# Altium schematic sheet A7_FUNCTION2 - Ⅱ.SchDoc
size A3
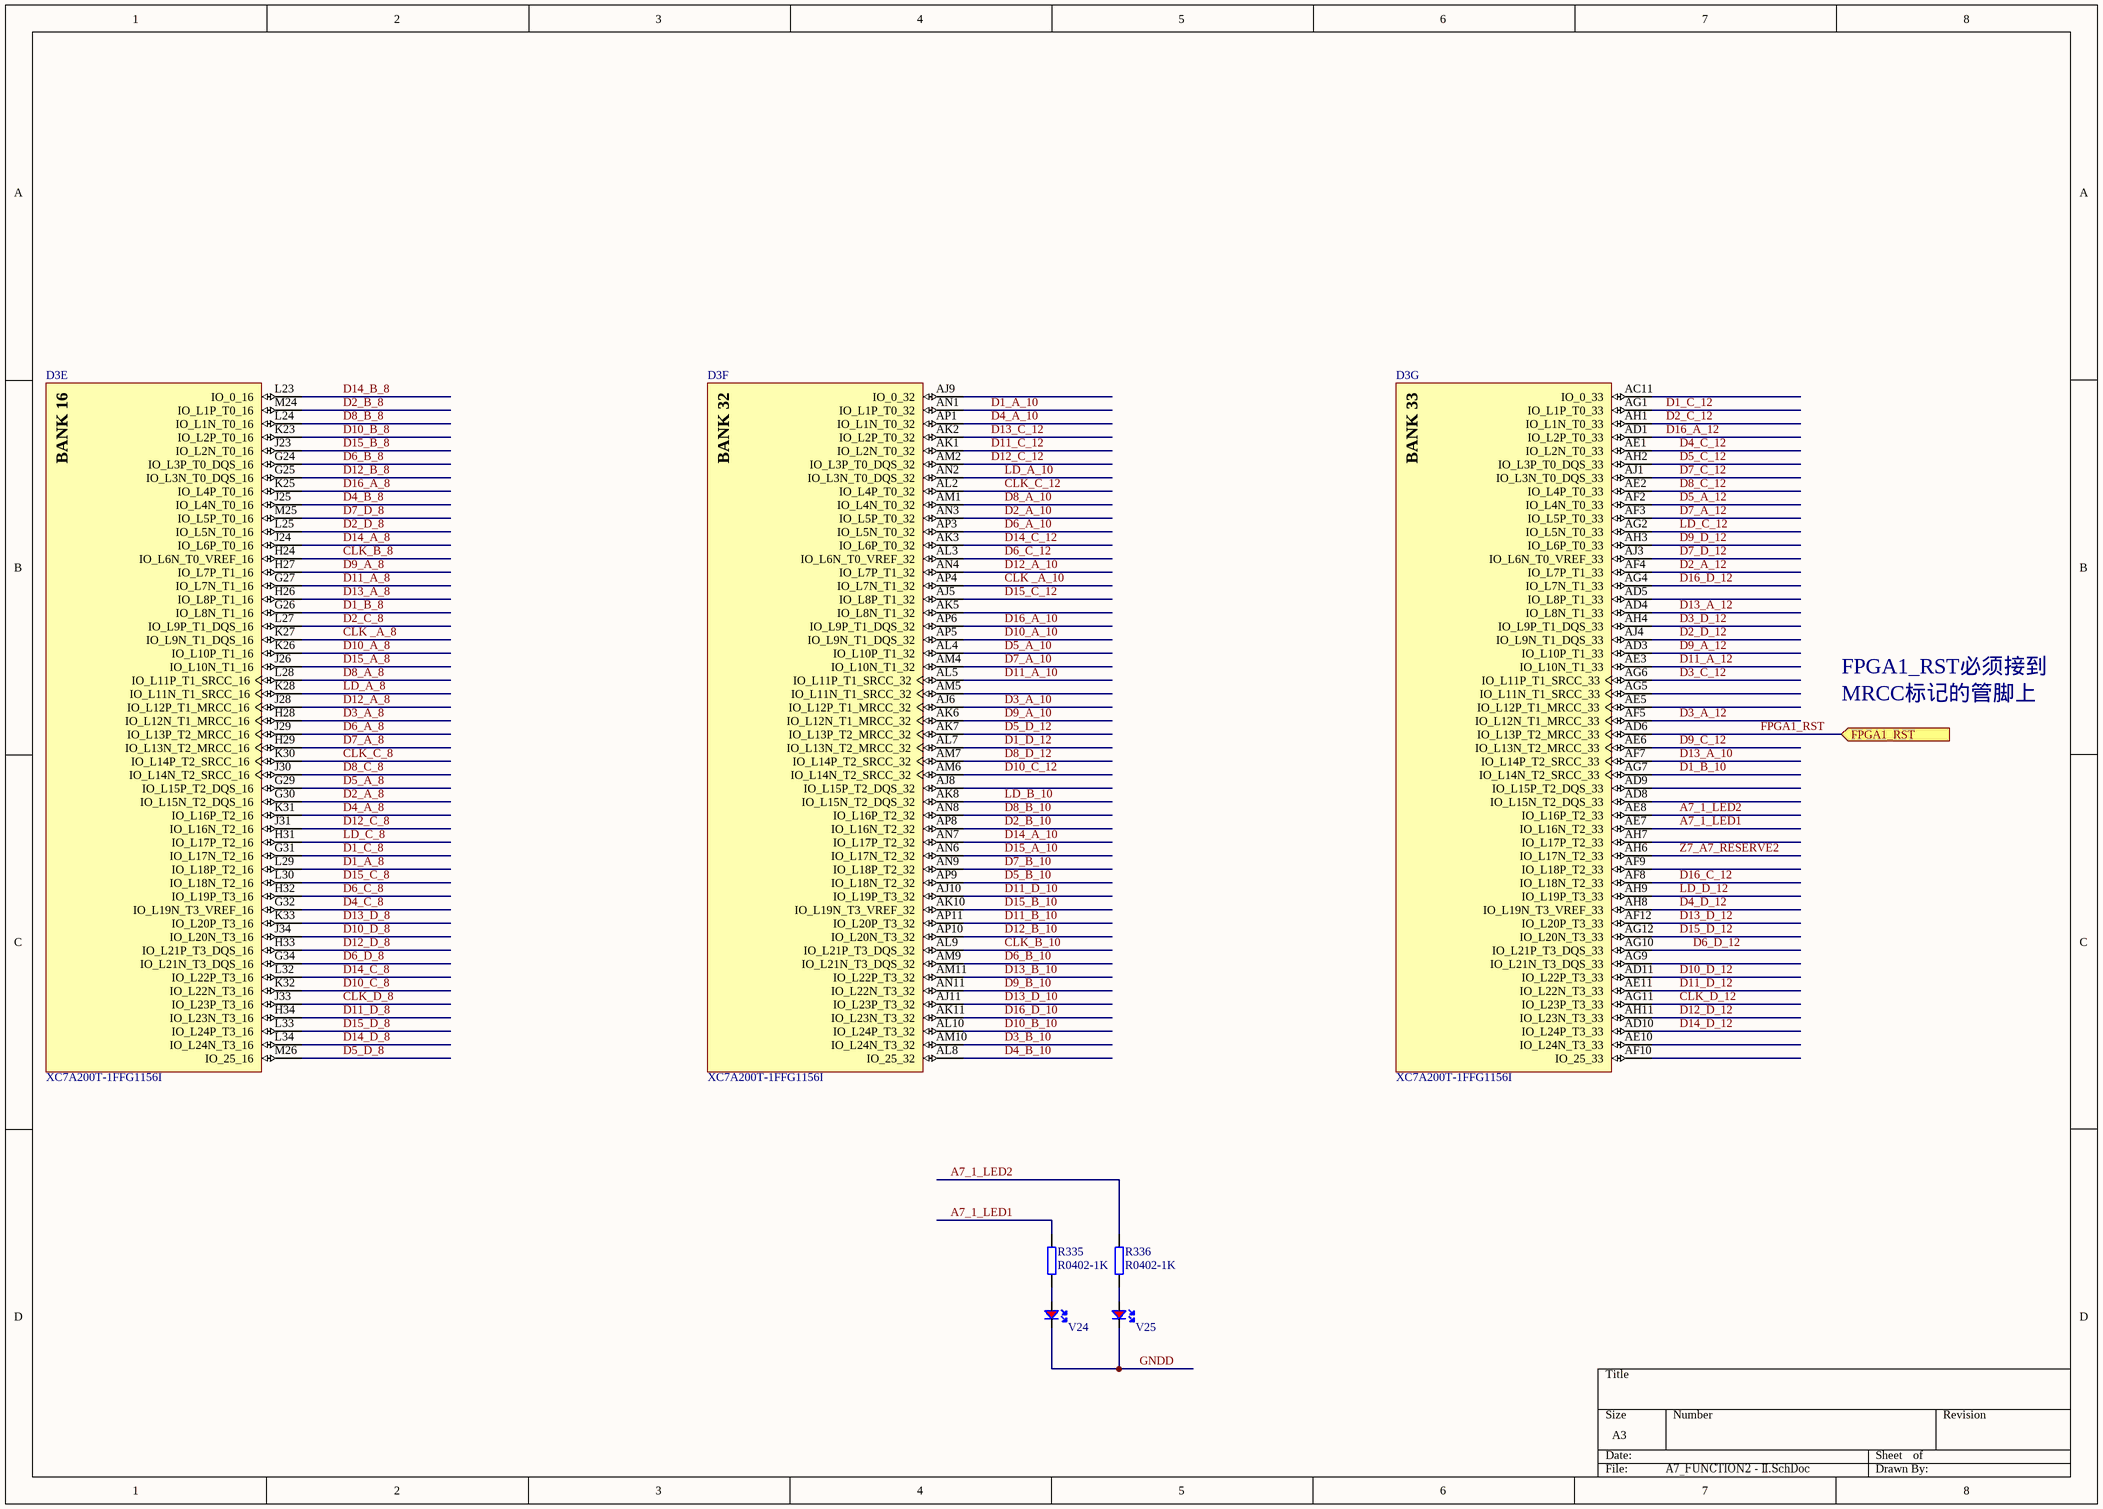
[diagram p0: A7_FUNCTION2 - Ⅱ.SchDoc]

## Parts
D3  XC7A200T-1FFG1156I  [FFG1156]  (parts E,F,G of 18)
R335  R0402-1K  [R0402]
R336  R0402-1K  [R0402]
V24  LED-R0603  [LED-R0603]  (value not drawn)
V25  LED-R0603  [LED-R0603]  (value not drawn)

## Ports
FPGA1_RST (in)

## Nets
A7_1_LED1: D3.AE7(IO_L16N_T2_33) R335.2
A7_1_LED2: D3.AE8(IO_L16P_T2_33) R336.2
CLK _A_8: D3.K27(IO_L9N_T1_DQS_16)
CLK _A_10: D3.AP4(IO_L7N_T1_32)
CLK_B_8: D3.H24(IO_L6N_T0_VREF_16)
CLK_B_10: D3.AL9(IO_L21P_T3_DQS_32)
CLK_C_8: D3.K30(IO_L14P_T2_SRCC_16)
CLK_C_12: D3.AL2(IO_L4P_T0_32)
CLK_D_8: D3.J33(IO_L23P_T3_16)
CLK_D_12: D3.AG11(IO_L23P_T3_33)
D1_A_8: D3.L29(IO_L18P_T2_16)
D1_A_10: D3.AN1(IO_L1P_T0_32)
D1_B_8: D3.G26(IO_L8N_T1_16)
D1_B_10: D3.AG7(IO_L14N_T2_SRCC_33)
D1_C_8: D3.G31(IO_L17N_T2_16)
D1_C_12: D3.AG1(IO_L1P_T0_33)
D1_D_12: D3.AL7(IO_L13N_T2_MRCC_32)
D2_A_8: D3.G30(IO_L15N_T2_DQS_16)
D2_A_10: D3.AN3(IO_L5P_T0_32)
D2_A_12: D3.AF4(IO_L7P_T1_33)
D2_B_8: D3.M24(IO_L1P_T0_16)
D2_B_10: D3.AP8(IO_L16N_T2_32)
D2_C_8: D3.L27(IO_L9P_T1_DQS_16)
D2_C_12: D3.AH1(IO_L1N_T0_33)
D2_D_8: D3.L25(IO_L5N_T0_16)
D2_D_12: D3.AJ4(IO_L9N_T1_DQS_33)
D3_A_8: D3.H28(IO_L12N_T1_MRCC_16)
D3_A_10: D3.AJ6(IO_L12P_T1_MRCC_32)
D3_A_12: D3.AF5(IO_L12N_T1_MRCC_33)
D3_B_10: D3.AM10(IO_L24N_T3_32)
D3_C_12: D3.AG6(IO_L11P_T1_SRCC_33)
D3_D_12: D3.AH4(IO_L9P_T1_DQS_33)
D4_A_8: D3.K31(IO_L16P_T2_16)
D4_A_10: D3.AP1(IO_L1N_T0_32)
D4_B_8: D3.J25(IO_L4N_T0_16)
D4_B_10: D3.AL8(IO_25_32)
D4_C_8: D3.G32(IO_L19N_T3_VREF_16)
D4_C_12: D3.AE1(IO_L2N_T0_33)
D4_D_12: D3.AH8(IO_L19N_T3_VREF_33)
D5_A_8: D3.G29(IO_L15P_T2_DQS_16)
D5_A_10: D3.AL4(IO_L10P_T1_32)
D5_A_12: D3.AF2(IO_L4N_T0_33)
D5_B_10: D3.AP9(IO_L18N_T2_32)
D5_C_12: D3.AH2(IO_L3P_T0_DQS_33)
D5_D_8: D3.M26(IO_25_16)
D5_D_12: D3.AK7(IO_L13P_T2_MRCC_32)
D6_A_8: D3.J29(IO_L13P_T2_MRCC_16)
D6_A_10: D3.AP3(IO_L5N_T0_32)
D6_B_8: D3.G24(IO_L3P_T0_DQS_16)
D6_B_10: D3.AM9(IO_L21N_T3_DQS_32)
D6_C_8: D3.H32(IO_L19P_T3_16)
D6_C_12: D3.AL3(IO_L6N_T0_VREF_32)
D6_D_8: D3.G34(IO_L21N_T3_DQS_16)
D6_D_12: D3.AG10(IO_L21P_T3_DQS_33)
D7_A_8: D3.H29(IO_L13N_T2_MRCC_16)
D7_A_10: D3.AM4(IO_L10N_T1_32)
D7_A_12: D3.AF3(IO_L5P_T0_33)
D7_B_10: D3.AN9(IO_L18P_T2_32)
D7_C_12: D3.AJ1(IO_L3N_T0_DQS_33)
D7_D_8: D3.M25(IO_L5P_T0_16)
D7_D_12: D3.AJ3(IO_L6N_T0_VREF_33)
D8_A_8: D3.L28(IO_L11P_T1_SRCC_16)
D8_A_10: D3.AM1(IO_L4N_T0_32)
D8_B_8: D3.L24(IO_L1N_T0_16)
D8_B_10: D3.AN8(IO_L16P_T2_32)
D8_C_8: D3.J30(IO_L14N_T2_SRCC_16)
D8_C_12: D3.AE2(IO_L4P_T0_33)
D8_D_12: D3.AM7(IO_L14P_T2_SRCC_32)
D9_A_8: D3.H27(IO_L7P_T1_16)
D9_A_10: D3.AK6(IO_L12N_T1_MRCC_32)
D9_A_12: D3.AD3(IO_L10P_T1_33)
D9_B_10: D3.AN11(IO_L22N_T3_32)
D9_C_12: D3.AE6(IO_L13N_T2_MRCC_33)
D9_D_12: D3.AH3(IO_L6P_T0_33)
D10_A_8: D3.K26(IO_L10P_T1_16)
D10_A_10: D3.AP5(IO_L9N_T1_DQS_32)
D10_B_8: D3.K23(IO_L2P_T0_16)
D10_B_10: D3.AL10(IO_L24P_T3_32)
D10_C_8: D3.K32(IO_L22N_T3_16)
D10_C_12: D3.AM6(IO_L14N_T2_SRCC_32)
D10_D_8: D3.J34(IO_L20N_T3_16)
D10_D_12: D3.AD11(IO_L22P_T3_33)
D11_A_8: D3.G27(IO_L7N_T1_16)
D11_A_10: D3.AL5(IO_L11P_T1_SRCC_32)
D11_A_12: D3.AE3(IO_L10N_T1_33)
D11_B_10: D3.AP11(IO_L20P_T3_32)
D11_C_12: D3.AK1(IO_L2N_T0_32)
D11_D_8: D3.H34(IO_L23N_T3_16)
D11_D_10: D3.AJ10(IO_L19P_T3_32)
D11_D_12: D3.AE11(IO_L22N_T3_33)
D12_A_8: D3.J28(IO_L12P_T1_MRCC_16)
D12_A_10: D3.AN4(IO_L7P_T1_32)
D12_B_8: D3.G25(IO_L3N_T0_DQS_16)
D12_B_10: D3.AP10(IO_L20N_T3_32)
D12_C_8: D3.J31(IO_L16N_T2_16)
D12_C_12: D3.AM2(IO_L3P_T0_DQS_32)
D12_D_8: D3.H33(IO_L21P_T3_DQS_16)
D12_D_12: D3.AH11(IO_L23N_T3_33)
D13_A_8: D3.H26(IO_L8P_T1_16)
D13_A_10: D3.AF7(IO_L14P_T2_SRCC_33)
D13_A_12: D3.AD4(IO_L8N_T1_33)
D13_B_10: D3.AM11(IO_L22P_T3_32)
D13_C_12: D3.AK2(IO_L2P_T0_32)
D13_D_8: D3.K33(IO_L20P_T3_16)
D13_D_10: D3.AJ11(IO_L23P_T3_32)
D13_D_12: D3.AF12(IO_L20P_T3_33)
D14_A_8: D3.J24(IO_L6P_T0_16)
D14_A_10: D3.AN7(IO_L17P_T2_32)
D14_B_8: D3.L23(IO_0_16)
D14_C_8: D3.L32(IO_L22P_T3_16)
D14_C_12: D3.AK3(IO_L6P_T0_32)
D14_D_8: D3.L34(IO_L24N_T3_16)
D14_D_12: D3.AD10(IO_L24P_T3_33)
D15_A_8: D3.J26(IO_L10N_T1_16)
D15_A_10: D3.AN6(IO_L17N_T2_32)
D15_B_8: D3.J23(IO_L2N_T0_16)
D15_B_10: D3.AK10(IO_L19N_T3_VREF_32)
D15_C_8: D3.L30(IO_L18N_T2_16)
D15_C_12: D3.AJ5(IO_L8P_T1_32)
D15_D_8: D3.L33(IO_L24P_T3_16)
D15_D_12: D3.AG12(IO_L20N_T3_33)
D16_A_8: D3.K25(IO_L4P_T0_16)
D16_A_10: D3.AP6(IO_L9P_T1_DQS_32)
D16_A_12: D3.AD1(IO_L2P_T0_33)
D16_C_12: D3.AF8(IO_L18N_T2_33)
D16_D_10: D3.AK11(IO_L23N_T3_32)
D16_D_12: D3.AG4(IO_L7N_T1_33)
FPGA1_RST: D3.AD6(IO_L13P_T2_MRCC_33) ; port FPGA1_RST
GNDD: V24.2(K) V25.2(K)
LD_A_8: D3.K28(IO_L11N_T1_SRCC_16)
LD_A_10: D3.AN2(IO_L3N_T0_DQS_32)
LD_B_10: D3.AK8(IO_L15N_T2_DQS_32)
LD_C_8: D3.H31(IO_L17P_T2_16)
LD_C_12: D3.AG2(IO_L5N_T0_33)
LD_D_12: D3.AH9(IO_L19P_T3_33)
Z7_A7_RESERVE2: D3.AH6(IO_L17N_T2_33)
NetR335_1: R335.1 V24.1(A)
NetR336_1: R336.1 V25.1(A)

Not connected (* = marked no-connect by the designer): D3 AC11(IO_0_33) AD5(IO_L8P_T1_33) AD8(IO_L15N_T2_DQS_33) AD9(IO_L15P_T2_DQS_33) AE5(IO_L12P_T1_MRCC_33) AE10(IO_L24N_T3_33) AF9(IO_L18P_T2_33) AF10(IO_25_33) AG5(IO_L11N_T1_SRCC_33) AG9(IO_L21N_T3_DQS_33) AH7(IO_L17P_T2_33) AJ8(IO_L15P_T2_DQS_32) AJ9(IO_0_32) AK5(IO_L8N_T1_32) AM5(IO_L11N_T1_SRCC_32)

## Notes on the sheet
- FPGA1_RST必须接到
- MRCC标记的管脚上
- (in symbol XC7A200T-1FFG1156I, part E) BANK 16
- (in symbol XC7A200T-1FFG1156I, part F) BANK 32
- (in symbol XC7A200T-1FFG1156I, part G) BANK 33

## Library data of the parts
D3 = XC7A200T-1FFG1156I: Artix-7 FPGA, 500 User I/Os, 16 GTP, 1156-Ball BGA, Speed Grade 1, Industrial Grade, Pb-Free; Manufacturer: Xilinx; Block RAM Blocks (18Kb): 730; Block RAM Blocks (36Kb): 365; Block RAM Blocks (Max Kb): 13140; CLBs (Slices): 33650; Clock Mgmt Tiles (CMTs): 10; DSP48E1 Slices: 740; Logic Cells: 215360; Max User I/O: 500; Speed Grade: -1; DatasheetVersion: v1.12; PackageVersion: Rev 1.8; PackageReference: FFG1156; PackageDescription: Flip-Chip BGA, Body 35 x 35 mm, 1.0 mm Pitch; CLBs (Max Distributed RAM Kb): 2888; Generic Part Number: XC7A200T; RoHS: Pb-Free; Mounting Technology: Surface Mount; Code_JEDEC: MS-034-AAR-1; PartNumber: XC7A200T-1FFG1156I; ComponentLink1Description: Datasheet; ComponentLink1URL: http://www.xilinx.com/support/documentation/data_sheets/ds180_7Series_Overview.pdf; ComponentLink2Description: Package Specification; ComponentLink2URL: http://www.xilinx.com/support/documentation/user_guides/ug475_7Series_Pkg_Pinout.pdf; ComponentLink3Description: DC and Switching Characteristics; ComponentLink3URL: http://www.xilinx.com/support/documentation/data_sheets/ds181_Artix_7_Data_Sheet.pdf; ComponentLink4Description: Package File; ComponentLink4URL: http://www.xilinx.com/support/packagefiles/a7packages/xc7a200tfbg676pkg.txt; ComponentLink5Description: Packaging and Pinout; ComponentLink5URL: http://www.xilinx.com/support/documentation/user_guides/ug475_7Series_Pkg_Pinout.pdf
R335 R336 = R0402-10K: Manufacturer: SAMSUNG; Part_number: R0402-1K; Part_type: RES; Value: R0402-1K; Schematic_Part: RES; PCB_Footprint: R0402
V24 V25 = LED-R0603: 表贴发光二极管, 0603封装, 体积1.6x0.8mm, 红色, 高度0.8mm; Part_type: DIODES; Part_number: LED-R0603; Value: LED-R0603; Schematic_Part: LED-R; PCB_Footprint: LED-R0603